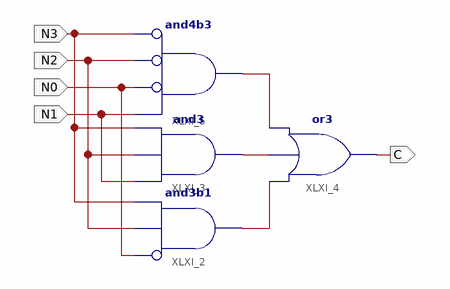
[diagram p0: schematic sheet 1]
// Xilinx ISE schematic comb_c.sch (spartan3e) as structural Verilog: 4 symbols, 5 ports
module comb_c (
  input  N3,
  input  N2,
  input  N0,
  input  N1,
  output C
);

  wire XLXN_1, XLXN_2, XLXN_3;

  and XLXI_2 (XLXN_3, ~N0, N2, N3);  // and3b1
  and XLXI_3 (XLXN_1, N1, N2, N3);
  or XLXI_4 (C, XLXN_3, XLXN_1, XLXN_2);
  and XLXI_5 (XLXN_2, ~N3, ~N2, ~N0, N1);  // and4b3
endmodule
